# Altium schematic sheet MCU.SchDoc
size B
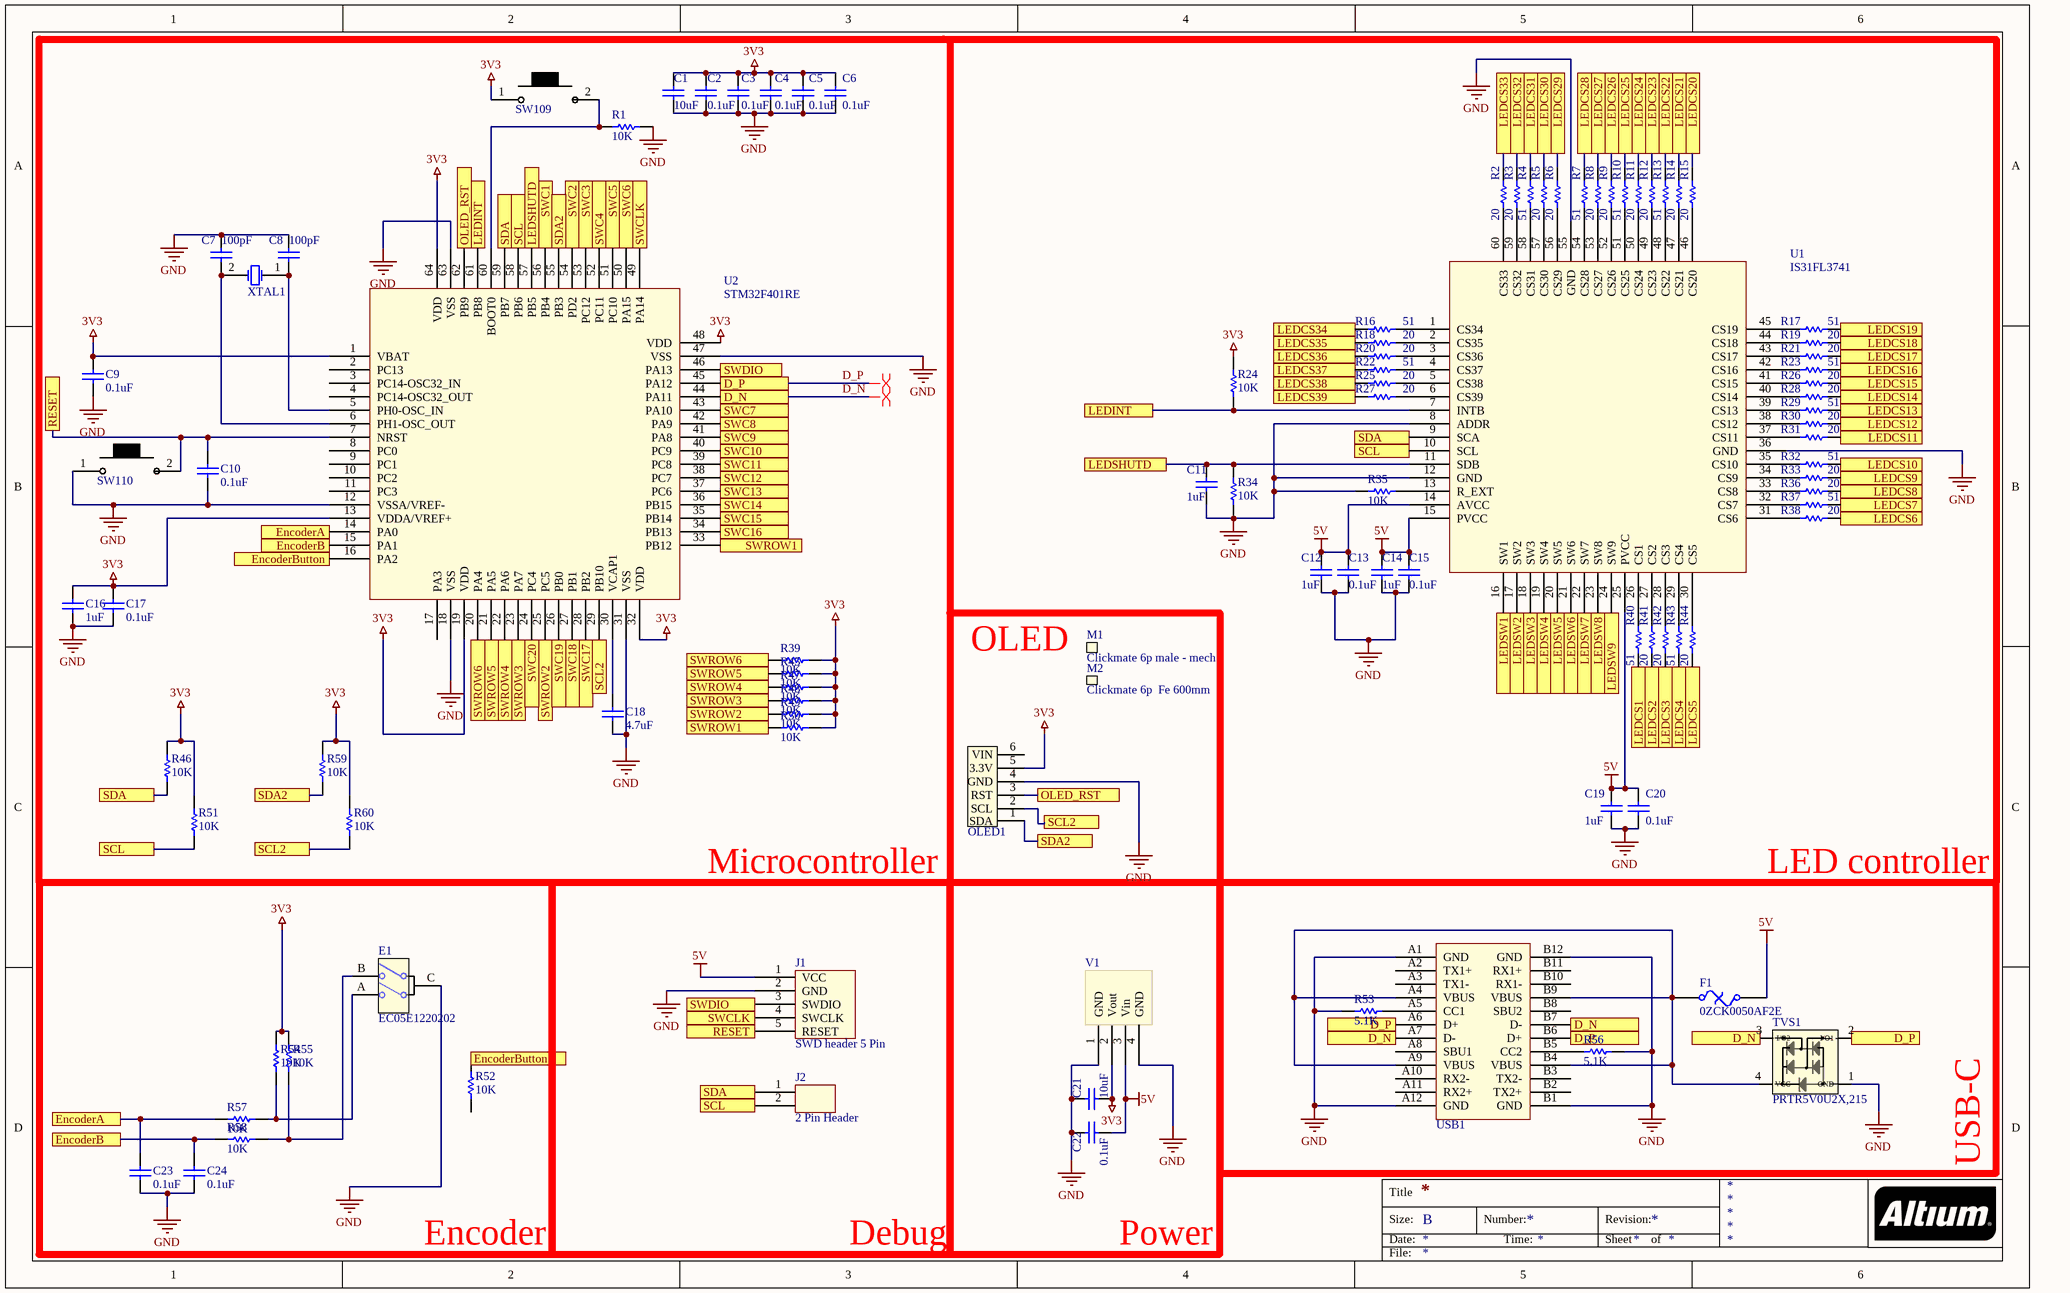
[diagram p0: MCU.SchDoc]

## Parts
C1  value 10uF  [0402_L_C]  (hidden comment: 10uF 6.3V X5R Ceramic)
C2  value 0.1uF  [0402_L_C]  (hidden comment: 0u1F 16V X7R)
C3  value 0.1uF  [0402_L_C]  (hidden comment: 0u1F 16V X7R)
C4  value 0.1uF  [0402_L_C]  (hidden comment: 0u1F 16V X7R)
C5  value 0.1uF  [0402_L_C]  (hidden comment: 0u1F 16V X7R)
C6  value 0.1uF  [0402_L_C]  (hidden comment: 0u1F 16V X7R)
C7  value 100pF  [0402_L_C]  (hidden comment: 30pF 50V np0)
C8  value 100pF  [0402_L_C]  (hidden comment: 30pF 50V np0)
C9  value 0.1uF  [0402_L_C]  (hidden comment: 0u1F 16V X7R)
C10  value 0.1uF  [0402_L_C]  (hidden comment: 0u1F 16V X7R)
C11  value 1uF  [0402_L_C]  (hidden comment: 1uF 25V X5R)
C12  value 1uF  [0402_L_C]  (hidden comment: 1uF 25V X5R)
C13  value 0.1uF  [0402_L_C]  (hidden comment: 0u1F 16V X7R)
C14  value 1uF  [0402_L_C]  (hidden comment: 1uF 25V X5R)
C15  value 0.1uF  [0402_L_C]  (hidden comment: 0u1F 16V X7R)
C16  value 1uF  [0402_L_C]  (hidden comment: 1uF 25V X5R)
C17  value 0.1uF  [0402_L_C]  (hidden comment: 0u1F 16V X7R)
C18  value 4.7uF  [0402_L_C]  (hidden comment: 4.7uF 10V X5R Ceramic)
C19  value 1uF  [0402_L_C]  (hidden comment: 1uF 25V X5R)
C20  value 0.1uF  [0402_L_C]  (hidden comment: 0u1F 16V X7R)
C21  value 10uF  [0402_L_C]  (hidden comment: 10uF 6.3V X5R Ceramic)
C22  value 0.1uF  [0402_L_C]  (hidden comment: 0u1F 16V X7R)
C23  value 0.1uF  [0402_L_C]  (hidden comment: 0u1F 16V X7R)
C24  value 0.1uF  [0402_L_C]  (hidden comment: 0u1F 16V X7R)
E1  EC05E1220202  [EC05E1220202]
F1  0ZCK0050AF2E  [0ZCK0050AF2E]
J1  SWD header 5 Pin  [SWD 5 Pin]
J2  2 Pin Header  [2 Pin Header]
M1  Clickmate 6p male - mech  (mechanical)
M2  Clickmate 6p  Fe 600mm  (mechanical)
OLED1  OLED MONO 128x32  [5025850670]  (value not drawn)
R1  10K  [0402_L]
R2  20  [0402_L]
R3  20  [0402_L]
R4  51  [0402_L]
R5  20  [0402_L]
R6  20  [0402_L]
R7  51  [0402_L]
R8  20  [0402_L]
R9  20  [0402_L]
R10  51  [0402_L]
R11  20  [0402_L]
R12  20  [0402_L]
R13  51  [0402_L]
R14  20  [0402_L]
R15  20  [0402_L]
R16  51  [0402_L]
R17  51  [0402_L]
R18  20  [0402_L]
R19  20  [0402_L]
R20  20  [0402_L]
R21  20  [0402_L]
R22  51  [0402_L]
R23  51  [0402_L]
R24  10K  [0402_L]
R25  20  [0402_L]
R26  20  [0402_L]
R27  20  [0402_L]
R28  20  [0402_L]
R29  51  [0402_L]
R30  20  [0402_L]
R31  20  [0402_L]
R32  51  [0402_L]
R33  20  [0402_L]
R34  10K  [0402_L]
R35  10K  [0402_L]
R36  20  [0402_L]
R37  51  [0402_L]
R38  20  [0402_L]
R39  10K  [0402_L]
R40  51  [0402_L]
R41  20  [0402_L]
R42  20  [0402_L]
R43  51  [0402_L]
R44  20  [0402_L]
R45  10K  [0402_L]
R46  10K  [0402_L]
R47  10K  [0402_L]
R48  10K  [0402_L]
R49  10K  [0402_L]
R50  10K  [0402_L]
R51  10K  [0402_L]
R52  10K  [0402_L]
R53  5.1K  [0402_L]
R54  10K  [0402_L]
R55  10K  [0402_L]
R56  5.1K  [0402_L]
R57  10K  [0402_L]
R58  10K  [0402_L]
R59  10K  [0402_L]
R60  10K  [0402_L]
SW109  B3U-1000P  [B3U-1000P]  (value not drawn)
SW110  B3U-1000P  [B3U-1000P]  (value not drawn)
TVS1  PRTR5V0U2X,215  [SOT143B-RF]
U1  IS31FL3741  [QFN-60 ISSI]
U2  STM32F401RE  [LQFP64-STM32]
USB1  USB C  [USB C]  (value not drawn)
V1  3.3Vreg  [SOT223 STM]  (value not drawn)
XTAL1  ATS08ASM-1E  [ATS25ASM-1E]  (value not drawn)

## Blocks framed on the sheet
Microcontroller: C1-C10 C16-C18 R1 R39 R45-R51 R59 R60 SW109 SW110 U2 XTAL1
Encoder: C23 C24 E1 R52 R54 R55 R57 R58
Power: C21 C22 V1

## Ports
D_N, D_P, EncoderA, EncoderB, EncoderButton, LEDCS1, LEDCS2, LEDCS3, LEDCS4, LEDCS5, LEDCS6, LEDCS7, LEDCS8, LEDCS9, LEDCS10, LEDCS11, LEDCS12, LEDCS13, LEDCS14, LEDCS15, LEDCS16, LEDCS17, LEDCS18, LEDCS19, LEDCS20, LEDCS21, LEDCS22, LEDCS23, LEDCS24, LEDCS25, LEDCS26, LEDCS27, LEDCS28, LEDCS29, LEDCS30, LEDCS31, LEDCS32, LEDCS33, LEDCS34, LEDCS35, LEDCS36, LEDCS37, LEDCS38, LEDCS39, LEDINT, LEDSHUTD, LEDSW1, LEDSW2, LEDSW3, LEDSW4, LEDSW5, LEDSW6, LEDSW7, LEDSW8, LEDSW9, OLED_RST, RESET, SCL, SCL2, SDA, SDA2, SWC1, SWC2, SWC3, SWC4, SWC5, SWC6, SWC7, SWC8, SWC9, SWC10, SWC11, SWC12, SWC13, SWC14, SWC15, SWC16, SWC17, SWC18, SWC19, SWC20, SWCLK, SWDIO, SWROW1, SWROW2, SWROW3, SWROW4, SWROW5, SWROW6

## Nets
3V3: C1.2 C2.2 C3.2 C4.2 C5.2 C6.2 C9.2 C16.2 C17.2 C21.2 OLED1.5(3.3V) R24.2 R39.1 R45.1 R46.2 R47.1 R48.1 R49.1 R50.1 R51.2 R54.2 R55.2 R59.2 R60.2 SW109.1 U2.1(VBAT) U2.13(VDDA/VREF+) U2.19(VDD) U2.32(VDD) U2.48(VDD) U2.64(VDD) V1.2(Vout)
5V: C12.2 C13.2 C14.2 C15.2 C19.2 C20.2 C22.2 F1.2 J1.1(VCC) U1.14(AVCC) U1.15(PVCC) U1.25(PVCC) V1.3(Vin)
GND: C1.1 C2.1 C3.1 C4.1 C5.1 C6.1 C7.2 C8.2 C9.1 C10.1 C11.1 C12.1 C13.1 C14.1 C15.1 C16.1 C17.1 C18.1 C19.1 C20.1 C21.1 C22.1 C23.1 C24.1 E1.C J1.2(GND) OLED1.4(GND) R1.2 R34.1 R35.2 R53.1 R56.2 SW110.1 TVS1.1(GND) U1.8(ADDR) U1.12(GND) U1.36(GND) U1.55(GND) U2.12(VSSA/VREF-) U2.18(VSS) U2.31(VSS) U2.47(VSS) U2.63(VSS) USB1.A1(GND) USB1.A12(GND) USB1.B1(GND) USB1.B12(GND) V1.1(GND) V1.4(GND)
D_N: TVS1.3(I/O2) U2.44(PA11) USB1.A7(D-) USB1.B7(D-) ; port D_N
D_P: TVS1.2(I/O1) U2.45(PA12) USB1.A6(D+) USB1.B6(D+) ; port D_P
EncoderA: C23.2 R57.2 U2.14(PA0) ; port EncoderA
EncoderB: C24.2 R58.2 U2.15(PA1) ; port EncoderB
EncoderButton: R52.2 U2.16(PA2) ; port EncoderButton
LEDCS1: R40.2 ; port LEDCS1
LEDCS2: R41.2 ; port LEDCS2
LEDCS3: R42.2 ; port LEDCS3
LEDCS4: R43.2 ; port LEDCS4
LEDCS5: R44.2 ; port LEDCS5
LEDCS6: R38.1 ; port LEDCS6
LEDCS7: R37.1 ; port LEDCS7
LEDCS8: R36.1 ; port LEDCS8
LEDCS9: R33.1 ; port LEDCS9
LEDCS10: R32.1 ; port LEDCS10
LEDCS11: R31.1 ; port LEDCS11
LEDCS12: R30.1 ; port LEDCS12
LEDCS13: R29.1 ; port LEDCS13
LEDCS14: R28.1 ; port LEDCS14
LEDCS15: R26.1 ; port LEDCS15
LEDCS16: R23.1 ; port LEDCS16
LEDCS17: R21.1 ; port LEDCS17
LEDCS18: R19.1 ; port LEDCS18
LEDCS19: R17.1 ; port LEDCS19
LEDCS20: R15.2 ; port LEDCS20
LEDCS21: R14.2 ; port LEDCS21
LEDCS22: R13.2 ; port LEDCS22
LEDCS23: R12.2 ; port LEDCS23
LEDCS24: R11.2 ; port LEDCS24
LEDCS25: R10.2 ; port LEDCS25
LEDCS26: R9.2 ; port LEDCS26
LEDCS27: R8.2 ; port LEDCS27
LEDCS28: R7.2 ; port LEDCS28
LEDCS29: R6.2 ; port LEDCS29
LEDCS30: R5.2 ; port LEDCS30
LEDCS31: R4.2 ; port LEDCS31
LEDCS32: R3.2 ; port LEDCS32
LEDCS33: R2.2 ; port LEDCS33
LEDCS34: R16.2 ; port LEDCS34
LEDCS35: R18.2 ; port LEDCS35
LEDCS36: R20.2 ; port LEDCS36
LEDCS37: R22.2 ; port LEDCS37
LEDCS38: R25.2 ; port LEDCS38
LEDCS39: R27.2 ; port LEDCS39
LEDINT: R24.1 U1.7(INTB) U2.61(PB8) ; port LEDINT
LEDSHUTD: C11.2 R34.2 U1.11(SDB) U2.57(PB5) ; port LEDSHUTD
LEDSW1: U1.16(SW1) ; port LEDSW1
LEDSW2: U1.17(SW2) ; port LEDSW2
LEDSW3: U1.18(SW3) ; port LEDSW3
LEDSW4: U1.19(SW4) ; port LEDSW4
LEDSW5: U1.20(SW5) ; port LEDSW5
LEDSW6: U1.21(SW6) ; port LEDSW6
LEDSW7: U1.22(SW7) ; port LEDSW7
LEDSW8: U1.23(SW8) ; port LEDSW8
LEDSW9: U1.24(SW9) ; port LEDSW9
OLED_RST: OLED1.3(RST) U2.62(PB9) ; port OLED_RST
RESET: C10.2 J1.5(RESET) SW110.2 U2.7(NRST) ; port RESET
SCL: J2.2 R51.1 U1.10(SCL) U2.58(PB6) ; port SCL
SCL2: OLED1.2(SCL) R60.1 U2.29(PB10) ; port SCL2
SDA: J2.1 R46.1 U1.9(SCA) U2.59(PB7) ; port SDA
SDA2: OLED1.1(SDA) R59.1 U2.55(PB3) ; port SDA2
SWC1: U2.56(PB4) ; port SWC1
SWC2: U2.54(PD2) ; port SWC2
SWC3: U2.53(PC12) ; port SWC3
SWC4: U2.52(PC11) ; port SWC4
SWC5: U2.51(PC10) ; port SWC5
SWC6: U2.50(PA15) ; port SWC6
SWC7: U2.43(PA10) ; port SWC7
SWC8: U2.42(PA9) ; port SWC8
SWC9: U2.41(PA8) ; port SWC9
SWC10: U2.40(PC9) ; port SWC10
SWC11: U2.39(PC8) ; port SWC11
SWC12: U2.38(PC7) ; port SWC12
SWC13: U2.37(PC6) ; port SWC13
SWC14: U2.36(PB15) ; port SWC14
SWC15: U2.35(PB14) ; port SWC15
SWC16: U2.34(PB13) ; port SWC16
SWC17: U2.28(PB2) ; port SWC17
SWC18: U2.27(PB1) ; port SWC18
SWC19: U2.26(PB0) ; port SWC19
SWC20: U2.24(PC4) ; port SWC20
SWCLK: J1.4(SWCLK) U2.49(PA14) ; port SWCLK
SWDIO: J1.3(SWDIO) U2.46(PA13) ; port SWDIO
SWROW1: R50.2 U2.33(PB12) ; port SWROW1
SWROW2: R49.2 U2.25(PC5) ; port SWROW2
SWROW3: R48.2 U2.23(PA7) ; port SWROW3
SWROW4: R47.2 U2.22(PA6) ; port SWROW4
SWROW5: R45.2 U2.21(PA5) ; port SWROW5
SWROW6: R39.2 U2.20(PA4) ; port SWROW6
NetC7_1: C7.1 U2.6(PH1-OSC_OUT) XTAL1.2(OSC2)
NetC8_1: C8.1 U2.5(PH0-OSC_IN) XTAL1.1(OSC1)
NetC18_2: C18.2 U2.30(VCAP1)
NetE1_A: E1.A R54.1 R57.1
NetE1_B: E1.B R55.1 R58.1
NetF1_1: F1.1 TVS1.4(VCC) USB1.A4(VBUS) USB1.A9(VBUS) USB1.B4(VBUS) USB1.B9(VBUS)
NetR1_1: R1.1 SW109.2 U2.60(BOOT0)
NetR2_1: R2.1 U1.60(CS33)
NetR3_1: R3.1 U1.59(CS32)
NetR4_1: R4.1 U1.58(CS31)
NetR5_1: R5.1 U1.57(CS30)
NetR6_1: R6.1 U1.56(CS29)
NetR7_1: R7.1 U1.54(CS28)
NetR8_1: R8.1 U1.53(CS27)
NetR9_1: R9.1 U1.52(CS26)
NetR10_1: R10.1 U1.51(CS25)
NetR11_1: R11.1 U1.50(CS24)
NetR12_1: R12.1 U1.49(CS23)
NetR13_1: R13.1 U1.48(CS22)
NetR14_1: R14.1 U1.47(CS21)
NetR15_1: R15.1 U1.46(CS20)
NetR16_1: R16.1 U1.1(CS34)
NetR17_2: R17.2 U1.45(CS19)
NetR18_1: R18.1 U1.2(CS35)
NetR19_2: R19.2 U1.44(CS18)
NetR20_1: R20.1 U1.3(CS36)
NetR21_2: R21.2 U1.43(CS17)
NetR22_1: R22.1 U1.4(CS37)
NetR23_2: R23.2 U1.42(CS16)
NetR25_1: R25.1 U1.5(CS38)
NetR26_2: R26.2 U1.41(CS15)
NetR27_1: R27.1 U1.6(CS39)
NetR28_2: R28.2 U1.40(CS14)
NetR29_2: R29.2 U1.39(CS13)
NetR30_2: R30.2 U1.38(CS12)
NetR31_2: R31.2 U1.37(CS11)
NetR32_2: R32.2 U1.35(CS10)
NetR33_2: R33.2 U1.34(CS9)
NetR35_1: R35.1 U1.13(R_EXT)
NetR36_2: R36.2 U1.33(CS8)
NetR37_2: R37.2 U1.32(CS7)
NetR38_2: R38.2 U1.31(CS6)
NetR40_1: R40.1 U1.26(CS1)
NetR41_1: R41.1 U1.27(CS2)
NetR42_1: R42.1 U1.28(CS3)
NetR43_1: R43.1 U1.29(CS4)
NetR44_1: R44.1 U1.30(CS5)
NetR53_2: R53.2 USB1.A5(CC1)
NetR56_1: R56.1 USB1.B5(CC2)

Not connected (* = marked no-connect by the designer): OLED1 6(VIN); R52 1; U2 2(PC13) 3(PC14-OSC32_IN) 4(PC14-OSC32_OUT) 8(PC0) 9(PC1) 10(PC2) 11(PC3) 17(PA3); USB1 A2(TX1+) A3(TX1-) A8(SBU1) A10(RX2-) A11(RX2+) B2(TX2+) B3(TX2-) B8(SBU2) B10(RX1-) B11(RX1+)

## Layout directives
differential pair: D_N, D_P

## Notes on the sheet
- OLED
- LED controller
- USB-C
- Debug
- Title
- Size:
- Date:
- B
- Number:
- Time:
- Revision:
- Sheet
- of
- File:

## Library data of the parts
C1 C21 = 10uF 6.3V X5R Ceramic: Capacitor; Published: 8-Jun-2000; LatestRevisionDate: 17-Jul-2002; LatestRevisionNote: Re-released for DXP Platform.; PackageReference: RAD-0.3; Publisher: Altium Limited; PackageDescription: Radial Cap, Thru-Hole; 2 Leads; 0.3 in Pin Spacing; Supplier 1: Mouser; Supplier Part Number 1: 81-GRJ155R60J106ME1D
C2-C6 C9 C10 C13 C15 C17 C20 C22-C24 = 0u1F 16V X7R: Capacitor; Published: 8-Jun-2000; LatestRevisionDate: 17-Jul-2002; LatestRevisionNote: Re-released for DXP Platform.; PackageReference: RAD-0.3; Publisher: Altium Limited; PackageDescription: Radial Cap, Thru-Hole; 2 Leads; 0.3 in Pin Spacing; Supplier 1: Mouser; Supplier Part Number 1: 81-GRM155R71C104KA88
C7 C8 = 30pF 50V np0: Capacitor; Published: 8-Jun-2000; LatestRevisionDate: 17-Jul-2002; LatestRevisionNote: Re-released for DXP Platform.; PackageReference: RAD-0.3; Publisher: Altium Limited; PackageDescription: Radial Cap, Thru-Hole; 2 Leads; 0.3 in Pin Spacing; Supplier 1: Mouser; Supplier Part Number 1: 603-CC402JRNPO9BN300
C11 C12 C14 C16 C19 = 1uF 25V X5R: Capacitor; Published: 8-Jun-2000; LatestRevisionDate: 17-Jul-2002; LatestRevisionNote: Re-released for DXP Platform.; PackageReference: RAD-0.3; Publisher: Altium Limited; PackageDescription: Radial Cap, Thru-Hole; 2 Leads; 0.3 in Pin Spacing; Supplier 1: Mouser; Supplier Part Number 1: 810-C1005X5R1E105M
C18 = 4.7uF 10V X5R Ceramic: Capacitor; Published: 8-Jun-2000; LatestRevisionDate: 17-Jul-2002; LatestRevisionNote: Re-released for DXP Platform.; PackageReference: RAD-0.3; Publisher: Altium Limited; PackageDescription: Radial Cap, Thru-Hole; 2 Leads; 0.3 in Pin Spacing; Supplier 1: Mouser; Supplier Part Number 1: 81-ZRB15XR61A475KE1D
F1 = 0ZCK0050AF2E: Thermal Fuse; Published: 24-Mar-1999; LatestRevisionDate: 17-Jul-2002; LatestRevisionNote: Re-released for DXP Platform.; PackageReference: PIN-W2/E2.8; Publisher: Altium Limited; PackageDescription: Thru-Hole; 2 Leads; Supplier 1: Mouser; Supplier Part Number 1: 530-0ZCK0050AF2E
M2 = ClickMate 6p female 600mm - mech: Supplier 1: Digi-Key; Supplier Part Number 1: WM16513-ND
R1 R24 R34 R35 R39 R45-R52 R54 R55 R57-R60 = 10K: Resistor; Published: 8-Jun-2000; LatestRevisionDate: 17-Jul-2002; LatestRevisionNote: Re-released for DXP Platform.; PackageReference: AXIAL-0.3; Publisher: Altium Limited; PackageDescription: Axial Device, Thru-Hole; 2 Leads; 0.3 in Pin Spacing; Supplier 1: Mouser; Supplier Part Number 1: 603-RC0402FR-0710KL; Value: 10K
R2 R3 R5 R6 R8 R9 R11 R12 R14 R15 R18-R21 R25-R28 R30 R31 R33 R36 R38 R41 R42 R44 = 20: Resistor; Published: 8-Jun-2000; LatestRevisionDate: 17-Jul-2002; LatestRevisionNote: Re-released for DXP Platform.; PackageReference: AXIAL-0.3; Publisher: Altium Limited; PackageDescription: Axial Device, Thru-Hole; 2 Leads; 0.3 in Pin Spacing; Supplier 1: Mouser; Supplier Part Number 1: 603-RC0402FR-0720RL; Value: 20
R4 R7 R10 R13 R16 R17 R22 R23 R29 R32 R37 R40 R43 = 51: Resistor; Published: 8-Jun-2000; LatestRevisionDate: 17-Jul-2002; LatestRevisionNote: Re-released for DXP Platform.; PackageReference: AXIAL-0.3; Publisher: Altium Limited; PackageDescription: Axial Device, Thru-Hole; 2 Leads; 0.3 in Pin Spacing; Supplier 1: Mouser; Supplier Part Number 1: 603-RC0402FR-0751RL; Value: 51
R53 R56 = 5.1K: Resistor; Published: 8-Jun-2000; LatestRevisionDate: 17-Jul-2002; LatestRevisionNote: Re-released for DXP Platform.; PackageReference: AXIAL-0.3; Publisher: Altium Limited; PackageDescription: Axial Device, Thru-Hole; 2 Leads; 0.3 in Pin Spacing; Value: 5.1K; Supplier 1: Mouser; Supplier Part Number 1: 71-CRCW0402J-5.1K-E3
V1 = LD1117S33CTR: Supplier 1: Digi-Key; Supplier Part Number 1: 497-1241-6-ND
XTAL1 = ATS08ASM-1E: 8MHz 60ESR 20pF; Supplier 1: Mouser; Supplier Part Number 1: 774-ATS08ASM-1E
E1 = EC05E1220202: Supplier 1: Mouser; Supplier Part Number 1: 688-EC05E1220202
M1 = Clickmate 6p male - mech: Supplier 1: Mouser; Supplier Part Number 1: 538-502585-0670
OLED1 = OLED MONO 128x32: Supplier 1: Mouser; Supplier Part Number 1: 485-931
SW109 SW110 = B3U-1000P: Supplier 1: Mouser; Supplier Part Number 1: 653-B3U-1000P
TVS1 = PRTR5V0U2X,215: Supplier 1: Mouser; Supplier Part Number 1: 771-PRTR5V0U2X-T/R
U1 = IS31FL3741: Supplier 1: Mouser; Supplier Part Number 1: 870-IS31FL3741QFLS4T
U2 = STM32F401RE: Supplier 1: Mouser; Supplier Part Number 1: 511-STM32F401RET6
USB1 = USB C: Supplier 1: Mouser; Supplier Part Number 1: 538-105455-0101